# Altium project micro thermometer.PrjPcb
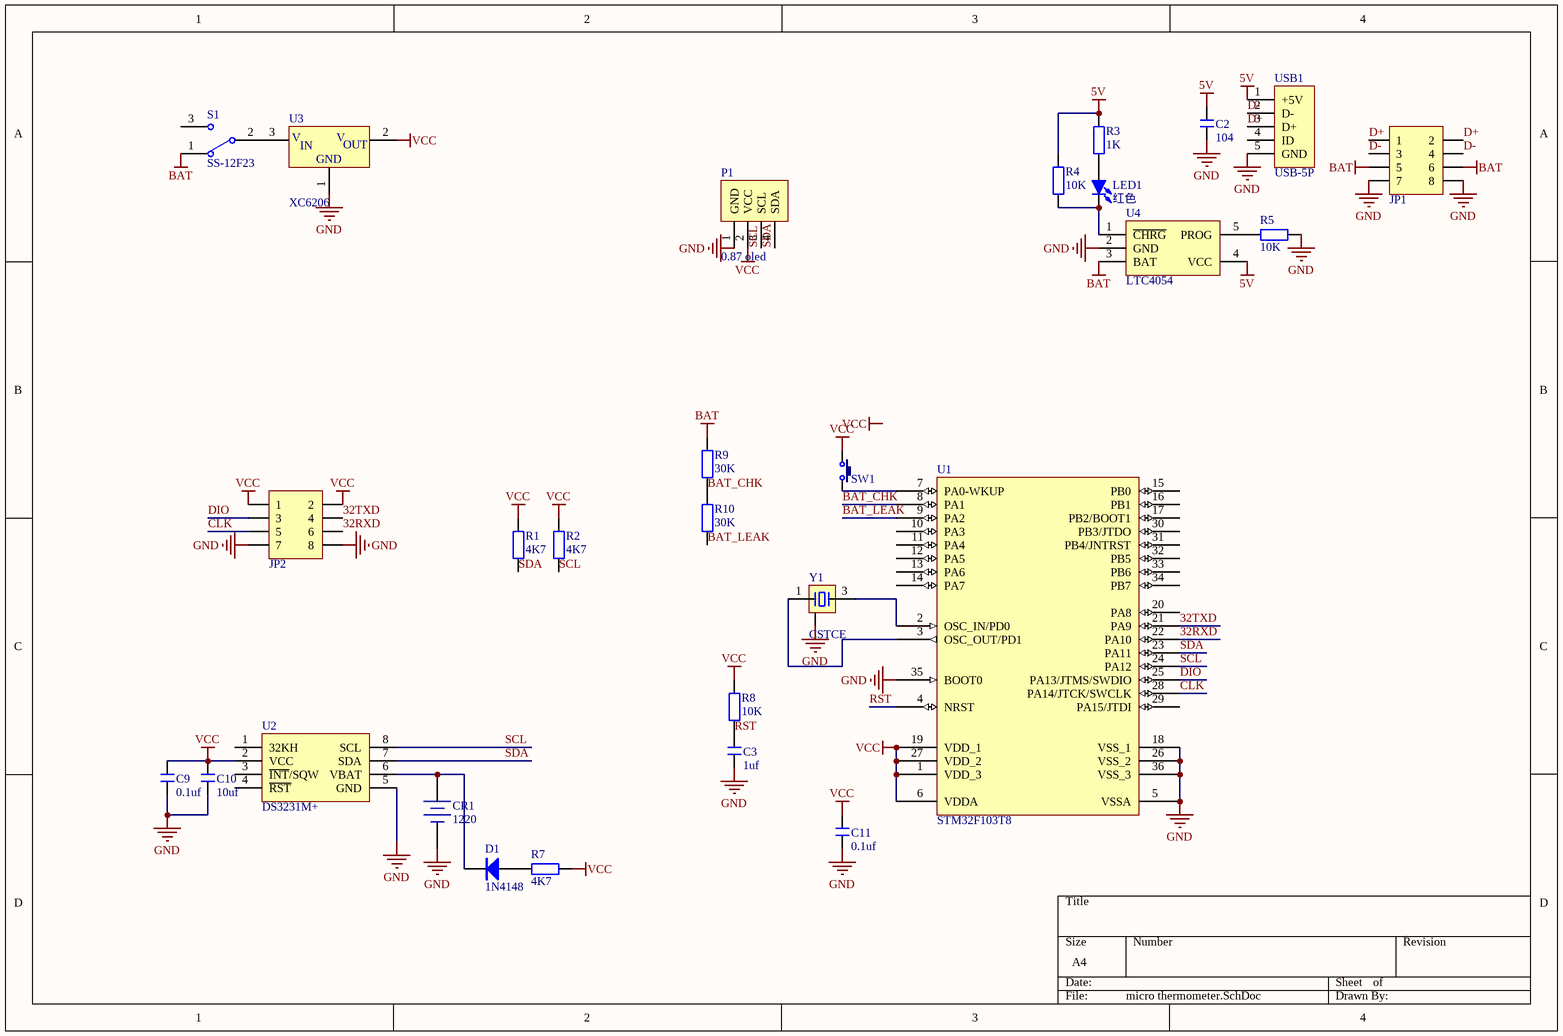
[diagram p0: micro thermometer.SchDoc]
2 sheets, 38 parts. Net scope: global (net labels, ports and power ports of the same name join across sheets).
Board files: micro thermometer.PcbDoc, tempbord.PcbDoc
Sheets:
  micro thermometer.SchDoc
  tempbord.SchDoc

## Sheet micro thermometer.SchDoc
size A4

### Parts
(Parts that share a designator on the sheet are numbered #1, #2 ... from top to bottom, then left to right.)
C2#1  104  [C 0603_M]
C3  1uf  [C 0603_L]
C9  0.1uf  [C 0603_L]
C10  10uf  [C 0603_L]
C11  0.1uf  [C 0603_L]
CR1  1220  [ML621FE]
D1  1N4148  [SOD-323]
JP1  Header 4X2  [HDR1.27-LS-2x4P]  (value not drawn)
JP2#1  Header 4X2  [HDR1.27-LS-2x4P]  (value not drawn)
LED1  红色  [LED 0603R]
P1#1  0.87 oled  [0.87 oled]
R1  4K7  [R 0603_L]
R2  4K7  [R 0603_L]
R3  1K  [R 0603_L]
R4  10K  [R 0603_L]
R5  10K  [R 0603_L]
R7#1  4K7  [R 0603_L]
R8  10K  [R 0603_L]
R9  30K  [R 0603_L]
R10  30K  [R 0603_L]
S1  SS-12F23  [MSK-12C01-07]
SW1  2x4x3.5  [SW 2*4*3.5 SMD]  (value not drawn)
U1  STM32F103T8  [VFQFN36 - 6*6]
U2#1  DS3231M+  [SOP8_N]
U3  XC6206  [SOT23-3L]
U4  LTC4054  [SOT23-5L]
USB1  USB-5P  [USB-MICRO_D]
Y1  CSTCE  [CSTCE]

### Nets
5V: C2#1.2 R3.2 R4.2 U4.4(VCC) USB1.1(+5V)
BAT: JP1.5 JP1.6 R9.2 S1.1 U4.3(BAT)
GND: C2#1.1 C3.1 C9.1 C10.1 C11.1 CR1.2(DC-) JP1.7 JP1.8 JP2#1.7 JP2#1.8 P1#1.1(GND) R5.2 U1.5(VSSA) U1.18(VSS_1) U1.26(VSS_2) U1.35(BOOT0) U1.36(VSS_3) U2#1.5(GND) U3.1(GND) U4.2(GND) USB1.5(GND) Y1.2
VCC: C9.2 C10.2 C11.2 JP2#1.1 JP2#1.2 P1#1.2(VCC) R1.2 R2.2 R7#1.2 R8.2 SW1.2 U1.1(VDD_3) U1.6(VDDA) U1.19(VDD_1) U1.27(VDD_2) U2#1.2(VCC) U3.2(VOUT)
32RXD: JP2#1.6 U1.22(PA10)
32TXD: JP2#1.4 U1.21(PA9)
BAT_CHK: R9.1 R10.2 U1.8(PA1)
BAT_LEAK: R10.1 U1.9(PA2)
CLK: JP2#1.5 U1.28(PA14/JTCK/SWCLK)
D+: JP1.1 JP1.2 USB1.3(D+)
D-: JP1.3 JP1.4 USB1.2(D-)
DIO: JP2#1.3 U1.25(PA13/JTMS/SWDIO)
RST: C3.2 R8.1 U1.4(NRST)
SCL: P1#1.3(SCL) R2.1 U1.24(PA12) U2#1.8(SCL)
SDA: P1#1.4(SDA) R1.1 U1.23(PA11) U2#1.7(SDA)
NetCR1_1: CR1.1(DC+) D1.2(K) U2#1.6(VBAT)
NetD1_1: D1.1(A) R7#1.1
NetLED1_1: LED1.1(A) R3.1
NetLED1_2: LED1.2(K) R4.1 U4.1(~{CHRG})
NetR5_1: R5.1 U4.5(PROG)
NetS1_2: S1.2 U3.3(VIN)
NetSW1_1: SW1.1 U1.7(PA0-WKUP)
NetU1_2: U1.2(OSC_IN/PD0) Y1.3
NetU1_3: U1.3(OSC_OUT/PD1) Y1.1

Not connected (* = marked no-connect by the designer): S1 3; U1 10(PA3) 11(PA4) 12(PA5) 13(PA6) 14(PA7) 15(PB0) 16(PB1) 17(PB2/BOOT1) 20(PA8) 29(PA15/JTDI) 30(PB3/JTDO) 31(PB4/JNTRST) 32(PB5) 33(PB6) 34(PB7); U2#1 1(32KH) 3(~{INT}/SQW) 4(~{RST}); USB1 4(ID)

### Notes on the sheet
- Labels drawn without touching a wire or pin: VCC
- (in symbol XC6206) V; IN; OUT

### Library data of the parts
C2#1 C3 C9-C11 = C: 无极性贴片电容; 版权归属: 源创客; BOM名称: 无极性贴片电容; 学习资源: www.ooocke.com
CR1 = CR-3V: 微型电池; 版权归属: 源创客; BOM名称: 微型电池; 学习资源: www.ooocke.com
D1 = 1N4148: 高速开关二极管; 版权归属: 源创客; BOM名称: 高速开关二极管; 学习资源: www.ooocke.com
JP1 JP2#1 = Header 4X2: 4*2P接插件; 版权归属: 源创客; BOM名称: 4*2P接插件; 学习资源: www.ooocke.com
LED1 = LED-SMD: 贴片LED; 版权归属: 源创客; BOM名称: 贴片LED; 学习资源: www.ooocke.com
R1-R5 R7#1 R8-R10 = R: 贴片电阻; 版权归属: 源创客; BOM名称: 贴片电阻; 学习资源: www.ooocke.com
S1 = SSW-1P: 1路波动开关; BOM名称: 波动开关; 版权归属: 源创客; 学习资源: www.ooocke.com
SW1 = SW 2x4: 2x4x3.5轻触开关SMD侧按键; 学?: www.ooocke.com
U3 = XC6206: 3-Terminal Positive Voltage Regulator
U4 = LTC4054: 独立线性锂电池充电器
USB1 = USB-5P: 微型USB母座; 版权归属: 源创客; BOM名称: 微型USB母座; 学习资源: www.ooocke.com
Y1 = CSTCE: 晶振

## Sheet tempbord.SchDoc
size A4
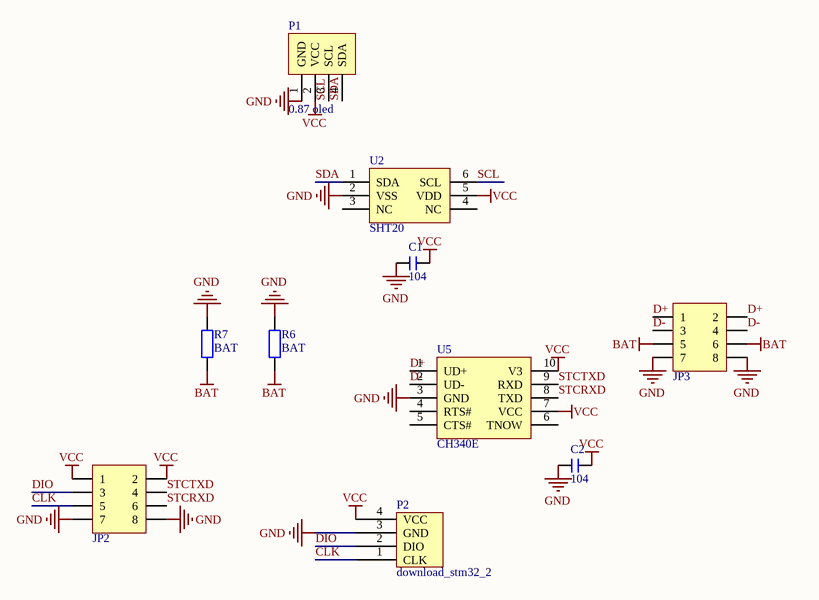
[diagram p1: tempbord.SchDoc]

### Parts
(Parts that share a designator on the sheet are numbered #1, #2 ... from top to bottom, then left to right.)
C1  104  [C 0603_L]
C2#2  104  [C 0603_L]
JP2#2  Header 4X2  [HDR1.27-LS-2x4P]  (value not drawn)
JP3  Header 4X2  [HDR1.27-M-LS-2x4P]  (value not drawn)
P1#2  0.87 oled  [0.87 oled]
P2  download_stm32_2  [download_round_1.27_stm32 - 2]
R6  BAT  [R 0805_L]
R7#2  BAT  [R 0805_L]
U2#2  SHT20  [DFN6 3*3]
U5  CH340E  [MSOP10_L]

### Nets
BAT: JP3.5 JP3.6 R6.1 R7#2.1
GND: C1.1 C2#2.1 JP2#2.7 JP2#2.8 JP3.7 JP3.8 P1#2.1(GND) P2.3(GND) R6.2 R7#2.2 U2#2.2(VSS) U5.3(GND)
VCC: C1.2 C2#2.2 JP2#2.1 JP2#2.2 P1#2.2(VCC) P2.4(VCC) U2#2.5(VDD) U5.7(VCC) U5.10(V3)
CLK: JP2#2.5 P2.1(CLK)
D+: JP3.1 JP3.2 U5.1(UD+)
D-: JP3.3 JP3.4 U5.2(UD-)
DIO: JP2#2.3 P2.2(DIO)
SCL: P1#2.3(SCL) U2#2.6(SCL)
SDA: P1#2.4(SDA) U2#2.1(SDA)
STCRXD: JP2#2.6 U5.8(TXD)
STCTXD: JP2#2.4 U5.9(RXD)

Not connected (* = marked no-connect by the designer): U2#2 3(NC) 4(NC); U5 4(RTS#) 5(CTS#) 6(TNOW)

### Library data of the parts
C1 C2#2 = C: 无极性贴片电容; 版权归属: 源创客; BOM名称: 无极性贴片电容; 学习资源: www.ooocke.com
JP2#2 JP3 = Header 4X2: 4*2P接插件; 版权归属: 源创客; BOM名称: 4*2P接插件; 学习资源: www.ooocke.com
R6 R7#2 = R: 贴片电阻; 版权归属: 源创客; BOM名称: 贴片电阻; 学习资源: www.ooocke.com

## Nets that join several sheets
BAT: micro thermometer (5 pins), tempbord (JP3.5 JP3.6 R6.1 R7#2.1)
GND: micro thermometer (22 pins), tempbord (12 pins)
VCC: micro thermometer (17 pins), tempbord (9 pins)
CLK: micro thermometer (JP2#1.5 U1.28), tempbord (JP2#2.5 P2.1)
D+: micro thermometer (JP1.1 JP1.2 USB1.3), tempbord (JP3.1 JP3.2 U5.1)
D-: micro thermometer (JP1.3 JP1.4 USB1.2), tempbord (JP3.3 JP3.4 U5.2)
DIO: micro thermometer (JP2#1.3 U1.25), tempbord (JP2#2.3 P2.2)
SCL: micro thermometer (P1#1.3 R2.1 U1.24 U2#1.8), tempbord (P1#2.3 U2#2.6)
SDA: micro thermometer (P1#1.4 R1.1 U1.23 U2#1.7), tempbord (P1#2.4 U2#2.1)